# EasyEDA Pro project watch-baseboard-v1.epro

# Schematic Schematic1
Board Name: Board1; Create Date: 2025-02-13; Page Name: P1; Project Name: watch-baseboard-v1; Schematic Name: Schematic1; Update Date: 2025-05-31; Company: 嘉立创EDA; Page Size: A4; Version: V1.0
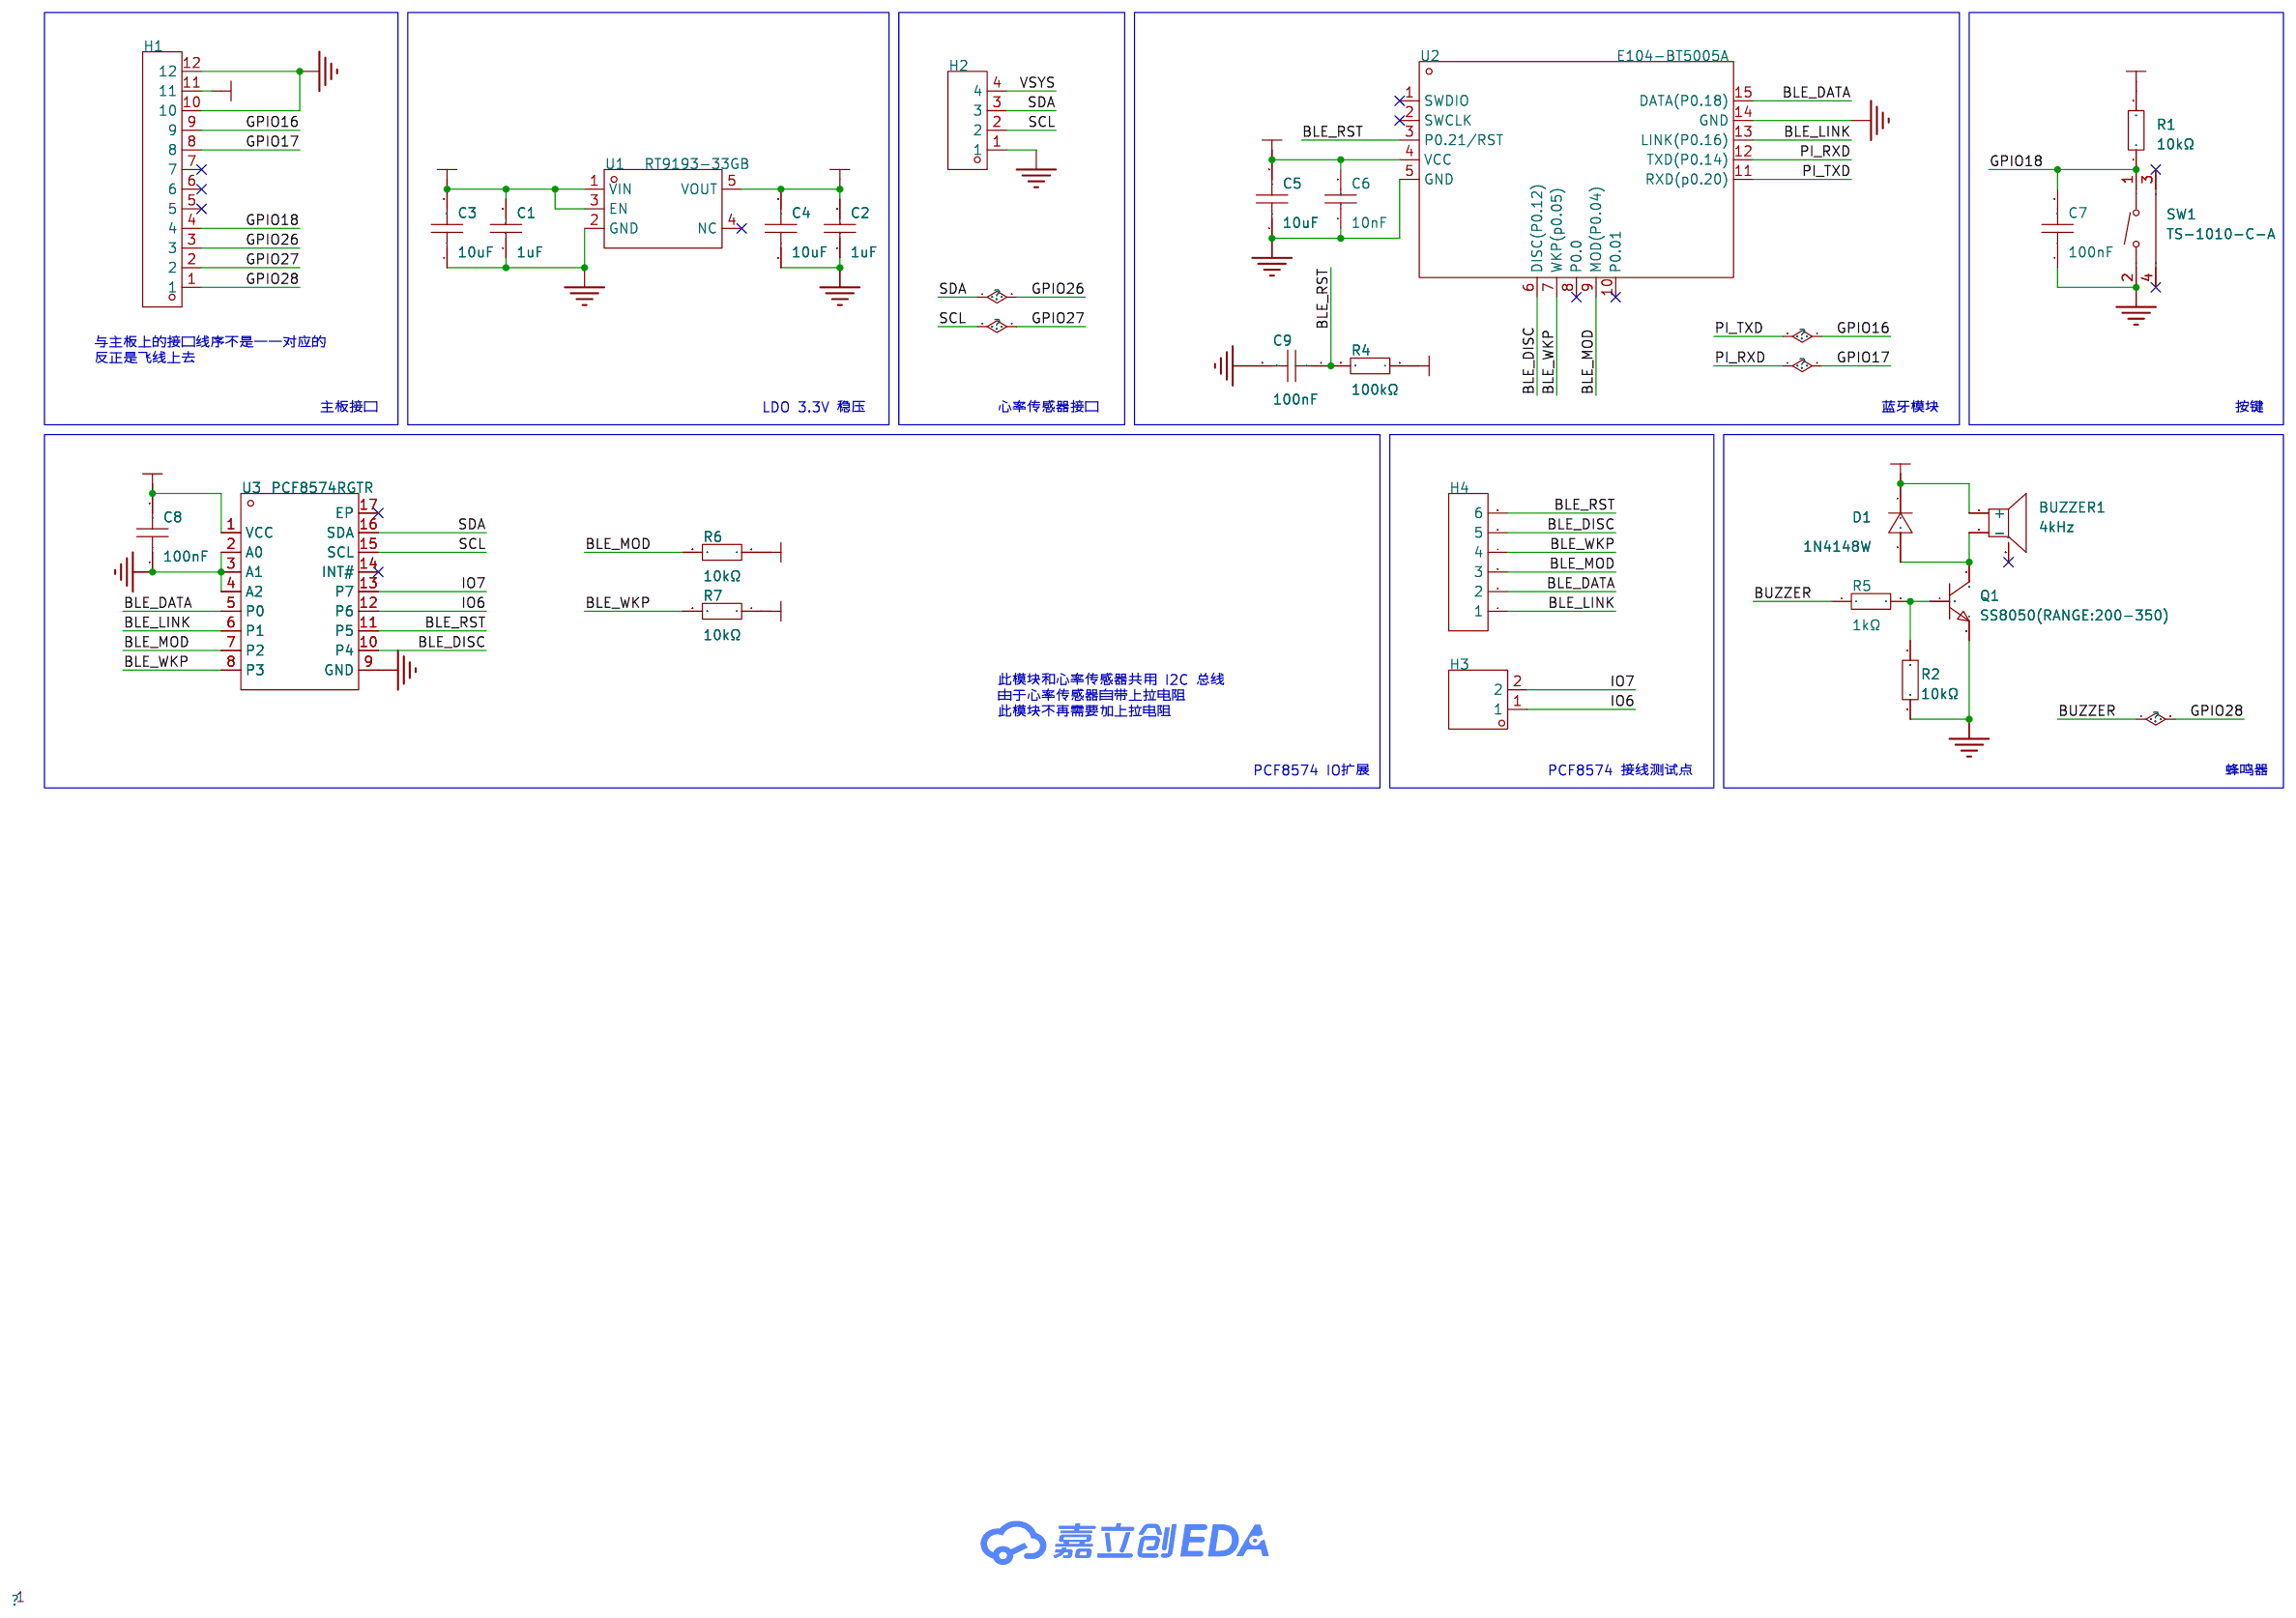
[diagram p0: schematic sheet]

## Parts
BUZZER1  4kHz  [BUZ-SMD_L5.0-W5.5-P4.60]
C1  1uF  [C0805]
C2  1uF  [C0805]
C3  10uF  [C0805]
C4  10uF  [C0805]
C5  10uF  [C0805]
C6  10nF  [C0805]
C7  100nF  [C0805]
C8  100nF  [C0805]
C9  100nF  [C0805]
D1  1N4148W  [SOD-123_L2.8-W1.8-LS3.7-RD]
H1  -  [HDR-TH_12P-P2.54-V-M]
H2  -  [HDR-TH_4P-P2.54-V-M]
H3  -  [HDR-TH_2P-P2.54-V-M-1]
H4  -  [HDR-TH_6P-P2.54-V-M-1]
Q1  SS8050(RANGE:200-350)  [SOT-23-3_L2.9-W1.3-P1.90-LS2.4-BR]
R1  10kΩ  [R0805]
R2  10kΩ  [R0805]
R4  100kΩ  [R0805]
R5  1kΩ  [R0805]
R6  10kΩ  [R0805]
R7  10kΩ  [R0805]
SW1  TS-1010-C-A  [KEY-SMD_TX-1010-X-X]
U1  RT9193-33GB  [SOT-23-5_L3.0-W1.5-P0.95-LS2.8-BL]
U2  E104-BT5005A  [BULETM-SMD_E104-BT5005A]
U3  PCF8574RGTR  [WQFN-16_L3.0-W3.0-P0.50-TL-EP1.6]

## Library data of the parts
BUZZER1 = MLT-5020: 驱动方式:无源(外部驱动);构造类型:电磁式;频率:4kHz;; Supplier Part: C94598; Manufacturer: 华能; Supplier Footprint: SMD,5x5mm; JLCPCB Part Class: 扩展库; Datasheet: https://atta.szlcsc.com/upload/public/pdf/source/20210811/111454390007D221D7259018FB170E62.pdf; Supplier: LCSC; Driver Circuitry: 无源(外部驱动); Technology: 电磁式; Length: 5.2mm; Width: 5.2mm; Height: 2.5mm
C1 C2 = CL21B105KBFNNNE: 容值:1uF;精度:±10%;额定电压:50V;材质(温度系数):X7R;; LCSC Part Name: 1uF ±10% 50V; Supplier Part: C28323; Manufacturer: SAMSUNG(三星); Supplier Footprint: 0805; JLCPCB Part Class: 基础库; Datasheet: https://atta.szlcsc.com/upload/public/pdf/source/20160218/1457707763339.pdf; Supplier: LCSC; Tolerance: ±10%; Voltage Rated: 50V; Temperature Coefficient: X7R
C3-C5 = CL21A106KAYNNNE_C15850: 容值:10uF;精度:±10%;额定电压:25V;材质(温度系数):X5R;; LCSC Part Name: 10uF ±10% 25V; Supplier Part: C15850; Manufacturer: SAMSUNG(三星); Manufacturer Part: CL21A106KAYNNNE; Supplier Footprint: 0805; JLCPCB Part Class: 基础库; Datasheet: https://atta.szlcsc.com/upload/public/pdf/source/20160218/1457707763339.pdf; Supplier: LCSC; Tolerance: ±10%; Voltage Rated: 25V; Temperature Coefficient: X5R
C6 = CL21B103KBANNNC: 容值:10nF;精度:±10%;额定电压:50V;材质(温度系数):X7R;; LCSC Part Name: 10nF ±10% 50V; Supplier Part: C1710; Manufacturer: SAMSUNG(三星); Supplier Footprint: 0805; JLCPCB Part Class: 基础库; Datasheet: https://atta.szlcsc.com/upload/public/pdf/source/20160218/1457707763339.pdf; Supplier: LCSC; Tolerance: ±10%; Voltage Rated: 50V; Temperature Coefficient: X7R
C7-C9 = CC0805KRX7R9BB104: 容值:100nF;精度:±10%;额定电压:50V;材质(温度系数):X7R;; LCSC Part Name: 100nF ±10% 50V; Supplier Part: C49678; Manufacturer: YAGEO(国巨); Supplier Footprint: 0805; JLCPCB Part Class: 基础库; Datasheet: https://atta.szlcsc.com/upload/public/pdf/source/20180224/C181747_15194369449651363981.pdf; Supplier: LCSC; Tolerance: ±10%; Voltage Rated: 50V; Temperature Coefficient: X7R
D1 = 1N4148W_C2099: 二极管配置:独立式;正向压降(Vf):1.25V@150mA;直流反向耐压(Vr):100V;整流电流:150mA;反向恢复时间(trr):4ns;; LCSC Part Name: 丝印T4; Supplier Part: C2099; Manufacturer: CJ(江苏长电/长晶); Supplier Footprint: SOD-123; JLCPCB Part Class: 扩展库; Datasheet: https://atta.szlcsc.com/upload/public/pdf/source/20120428/1457706480199.pdf; Supplier: LCSC; Diode Configuration: 独立式; Forward Voltage (Vf@If): 1.25V@150mA; Reverse Voltage (Vr): 100V; Rectified Current: 150mA; Reverse Leakage Current: 1uA@75V; Reverse Recovery Time (trr): 4ns
H1 = HDR-M_2.54_1x12P: 间距:2.54mm;总PIN位数:12;排数:1;插针结构:1x12P;行距:-;安装类型:直插;圆针/方针:方针;额定电流:3A;额定电压:250V;配合针长度:6mm;塑高:2.5mm;端接针长度:3mm;触头材质:-;工作温度范围:-40℃~+105℃;颜色:黑色;; Supplier Part: C2840012; Supplier Footprint: 插件
H2 = HDR-M_2.54_1x4P: Supplier Part: C492403; Supplier Footprint: 插件
H3 = HDR-M_2.54_1x2P: Supplier Part: C124375; Supplier Footprint: 插件
H4 = HDR-M_2.54_1x6P: Supplier Part: C37208; Supplier Footprint: 插件
Q1 = SS8050(RANGE:200-350)_C2150: 晶体管类型:NPN;集电极电流(Ic):1.5A;集射极击穿电压(Vceo):25V;功率(Pd):300mW;直流电流增益(hFE@Ic,Vce):200@800mA,1V;; LCSC Part Name: NPN 电流:1.5A 耐压:25V hfe=200~350; Supplier Part: C2150; Manufacturer: CJ(江苏长电/长晶); Supplier Footprint: SOT-23; JLCPCB Part Class: 基础库; Datasheet: https://atta.szlcsc.com/upload/public/pdf/source/20230322/AEE86F4B043774EFF80CAEA14A37D9E9.pdf; Supplier: LCSC; Transistor Type: NPN; Collector Current (Ic): 1.5A; Collector-Emitter Breakdown Voltage (Vceo): 25V; Power Dissipation (Pd): 300mW; DC Current Gain (hFE@Ic,Vce): 200@800mA,1V; Transition Frequency (fT): 100MHz; Collector Cut-Off Current (Icbo): 100nA; Collector-Emitter Saturation Voltage (VCE(sat)@Ic,Ib): 500mV@800mA,80mA; Operating Temperature: -55℃~+150℃
R1 R2 R6 R7 = 0805W8F1002T5E_C17414: 电阻类型:厚膜电阻;阻值:10kΩ;精度:±1%;功率:125mW;最大工作电压:150V;温度系数:±100ppm/℃;; LCSC Part Name: 10kΩ ±1% 125mW 厚膜电阻; Supplier Part: C17414; Manufacturer: UNI-ROYAL(厚声); Manufacturer Part: 0805W8F1002T5E; Supplier Footprint: 0805; JLCPCB Part Class: 基础库; Datasheet: https://atta.szlcsc.com/upload/public/pdf/source/20200306/C422600_1E6D84923E4A46A82E41ADD87F860B5C.pdf; Supplier: LCSC; Type: 厚膜电阻; Tolerance: ±1%; Power(Watts): 125mW; Overload Voltage (Max): 150V; Temperature Coefficient: ±100ppm/℃; Operating Temperature Range: -55℃~+155℃
R4 = 0805W8F1003T5E: 电阻类型:厚膜电阻;阻值:100kΩ;精度:±1%;功率:125mW;最大工作电压:150V;温度系数:±100ppm/℃;; LCSC Part Name: 100kΩ ±1% 125mW 厚膜电阻; Supplier Part: C149504; Manufacturer: UNI-ROYAL(厚声); Supplier Footprint: 0805; JLCPCB Part Class: 基础库; Datasheet: https://atta.szlcsc.com/upload/public/pdf/source/20200306/C422600_1E6D84923E4A46A82E41ADD87F860B5C.pdf; Supplier: LCSC; Type: 厚膜电阻; Tolerance: ±1%; Power(Watts): 125mW; Overload Voltage (Max): 150V; Temperature Coefficient: ±100ppm/℃; Operating Temperature Range: -55℃~+155℃
R5 = 0805W8F1001T5E: 电阻类型:厚膜电阻;阻值:1kΩ;精度:±1%;功率:125mW;最大工作电压:150V;温度系数:±100ppm/℃;; LCSC Part Name: 1kΩ ±1% 125mW 厚膜电阻; Supplier Part: C17513; Manufacturer: UNI-ROYAL(厚声); Supplier Footprint: 0805; JLCPCB Part Class: 基础库; Datasheet: https://atta.szlcsc.com/upload/public/pdf/source/20200306/C422600_1E6D84923E4A46A82E41ADD87F860B5C.pdf; Supplier: LCSC; Type: 厚膜电阻; Tolerance: ±1%; Power(Watts): 125mW; Overload Voltage (Max): 150V; Temperature Coefficient: ±100ppm/℃; Operating Temperature Range: -55℃~+155℃
SW1 = TS-1010-C-A: 电路结构:单刀单掷;按钮形状:矩形按钮;作用力:260gf;安装方式:卧贴;开关长度:2.3mm;开关宽度:4.7mm;开关高度:3.5mm;带支架:不带;触点电流:50mA;额定电压(AC):-;额定电压(DC):12V;额定功率:-;绝缘电阻:-;带灯:无;机械寿命:10万次;; LCSC Part Name: 2.3*4.7*3.5mm 卧贴 轻触开关; Supplier Part: C692458; Manufacturer: XKB Connectivity(中国星坤); Supplier Footprint: SMD; JLCPCB Part Class: 扩展库; Datasheet: https://atta.szlcsc.com/upload/public/pdf/source/20211011/09621D275CE0F472C941775DFBBCCC96.pdf; Supplier: LCSC; Circuit: 单刀单掷; Actuator Style: 矩形按钮; Operating Force: 260gf; Mounting Style: 卧贴; Switch Length: 2.3mm; Switch Width: 4.7mm; Switch Height: 3.5mm; Strike Gundam: 不带; Contact Current: 50mA; Voltage Rating (DC): 12V; Actuator/Cap Color: 黑色; With Lamp: 无; Mechanical Life: 10万次; Operating Temperature: -30℃~+85℃
U1 = RT9193-33GB_C19268156: Supplier Part: C19268156; Manufacturer: TECH PUBLIC(台舟); Supplier Footprint: SOT-23-5; JLCPCB Part Class: 扩展库; Datasheet: https://atta.szlcsc.com/upload/public/pdf/source/20231201/0E4AA64A86672323DAF7A55761D39120.pdf; Supplier: LCSC
U2 = E104-BT5005A: 基于nRF52805蓝牙协议 5.0 版本的串口转 BLE 蓝牙主从一体模块，体积小、功耗低，工作在 2.4GHz 频段。模块仅支持蓝牙主机、从机和观察者模式，模块在功能上支持低功耗广播、数据透传、空中配置。; LCSC Part Name: nRF52805 BLE5.0 低功耗蓝牙转串口模块; Supplier Part: C2874127; Manufacturer: EBYTE(亿佰特); Supplier Footprint: SMD; JLCPCB Part Class: 扩展库; Datasheet: https://atta.szlcsc.com/upload/public/pdf/source/20230131/53D67A473CAB63C2914FF2C9CC8CB02B.pdf; Supplier: LCSC
U3 = PCF8574RGTR: 接口:-;; Supplier Part: C2652270; Manufacturer: TI(德州仪器); Supplier Footprint: WQFN-16-EP(3x3); JLCPCB Part Class: 扩展库; Datasheet: https://www.ti.com/cn/lit/gpn/pcf8574; Supplier: LCSC

## Nets
3V3: BUZZER1.1(+) C2.2 C4.2 C5.2 C6.2 C8.2 D1.1(K) R1.2 R4.1 R6.1 R7.1 U1.5(VOUT) U2.4(VCC) U3.1(VCC)
GND: C1.1 C2.1 C3.1 C4.1 C5.1 C6.1 C7.1 C8.1 C9.2 H1.10 H1.12 H2.1 Q1.2(E) R2.1 SW1.2 U1.2(GND) U2.5(GND) U2.14(GND) U3.2(A0) U3.3(A1) U3.4(A2) U3.9(GND)
BLE_DATA: H4.2 U2.15(DATA(P0.18)) U3.5(P0)
BLE_DISC: H4.5 U2.6(DISC(P0.12)) U3.10(P4)
BLE_LINK: H4.1 U2.13(LINK(P0.16)) U3.6(P1)
BLE_MOD: H4.3 R6.2 U2.9(MOD(P0.04)) U3.7(P2)
BLE_RST: C9.1 H4.6 R4.2 U2.3(P0.21/RST) U3.11(P5)
BLE_WKP: H4.4 R7.2 U2.7(WKP(p0.05)) U3.8(P3)
BUZZER: H1.1 R5.1
GPIO16: H1.9 U2.11(RXD(p0.20))
GPIO17: H1.8 U2.12(TXD(P0.14))
GPIO18: C7.2 H1.4 R1.1 SW1.1
GPIO26: H1.3 H2.3 U3.16(SDA)
GPIO27: H1.2 H2.2 U3.15(SCL)
IO6: H3.1 U3.12(P6)
IO7: H3.2 U3.13(P7)
VSYS: C1.2 C3.2 H1.11 H2.4 U1.1(VIN) U1.3(EN)
$1N4188: Q1.1(B) R2.2 R5.2
$1N4201: BUZZER1.2(-) D1.2(A) Q1.3(C)

Not connected (* = marked no-connect by the designer): BUZZER1 3(NC)*; H1 5* 6* 7*; SW1 3* 4*; U1 4(NC)*; U2 1(SWDIO)* 2(SWCLK)* 8(P0.0)* 10(P0.01)*; U3 14(INT#)* 17(EP)*

## Notes on the sheet
- 与主板上的接口线序不是一一对应的
  反正是飞线上去
- 主板接口
- LDO 3.3V 稳压
- 心率传感器接口
- 蓝牙模块
- 按键
- 此模块和心率传感器共用 I2C 总线
  由于心率传感器自带上拉电阻
  此模块不再需要加上拉电阻
- PCF8574 IO扩展
- PCF8574 接线测试点
- 蜂鸣器

# Board PCB1
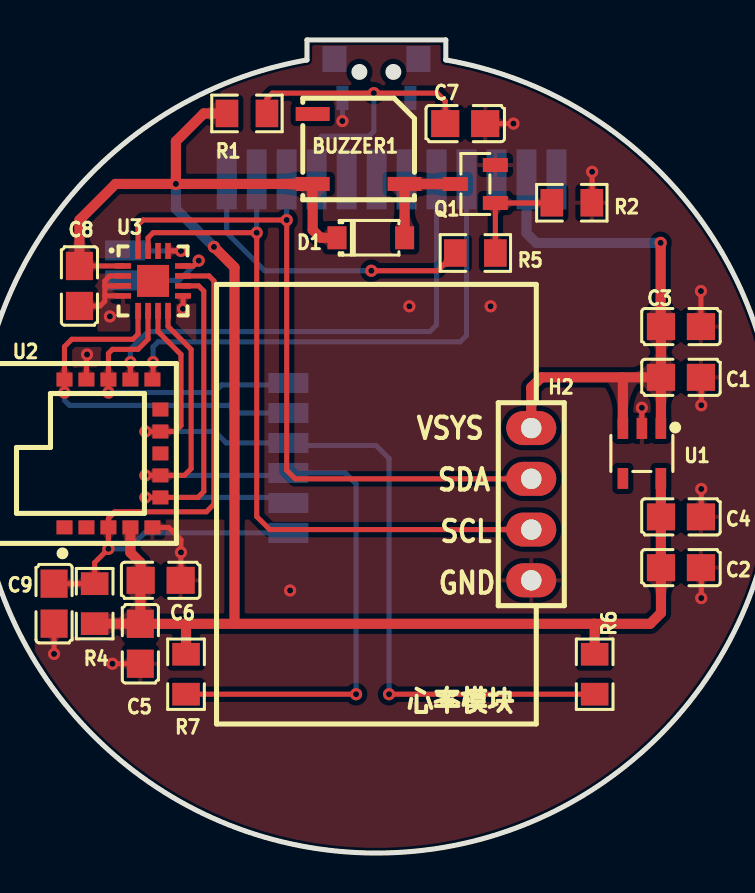
[diagram p1: board, top side]
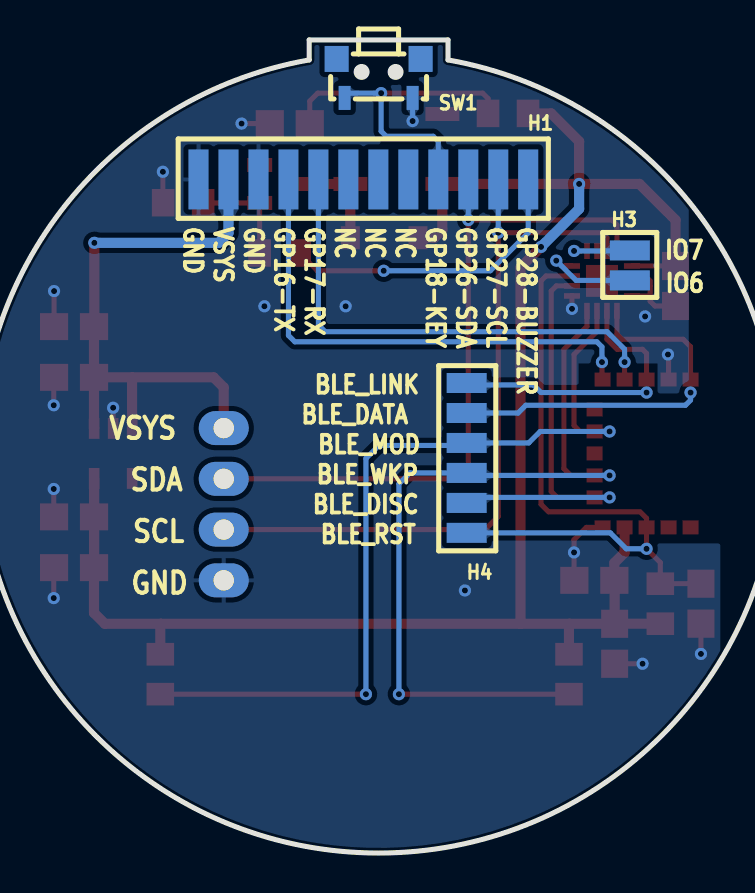
[diagram p2: board, bottom side, seen from below]

Outline 40 x 40.7 mm; copper layers: Top Layer, Bottom Layer. Coordinates in mm from the lower left corner of the outline.
Outline path: 16.53,40.7 23.48,40.7 23.48,39.7 arc(20,0) 16.53,39.7 16.53,40.7
Stack: Top Layer 0.035mm / Dielectric1 1.51mm FR4 er 4.5 / Bottom Layer 0.035mm

## Design rules (mm)
template: JLCPCB Capability(Two Layers Board)
spacing copperThickness1oz (default): track to track 0.102, other pairs 0.152 to 0.3
spacing copperThickness2oz: track to track 0.203, other pairs 0.152 to 0.3
track width copperThickness1oz (default): min 0.127, default 0.254, max 2.54
track width copperThickness2oz: min 0.203, default 0.254, max 2.54
differential pair differentialPair (default): width min 0.127, default 0.254, max 2.54; gap min 0.152, default 0.152
via viaSize (default): diameter min 0.5, default 0.61, max 10; hole min 0.3, default 0.305, max 6.3

## Placement (name value [footprint] x y rotation side)
BUZZER1  4kHz  [BUZ-SMD_L5.0-W5.5-P4.60]  19.11 35.24 0 top
C1  1uF  [C0805]  35.24 23.81 180 top
C2  1uF  [C0805]  35.24 14.28 180 top
C3  10uF  [C0805]  35.24 26.35 180 top
C4  10uF  [C0805]  35.24 16.82 180 top
C5  10uF  [C0805]  8.19 10.47 90 top
C6  10nF  [C0805]  9.21 13.65 180 top
C7  100nF  [C0805]  24.45 36.51 180 top
C8  100nF  [C0805]  5.14 28.38 90 top
C9  100nF  [C0805]  3.87 12.48 270 top
D1  1N4148W  [SOD-123_L2.8-W1.8-LS3.7-RD]  19.72 30.79 0 top
H1  -  [HDR-TH_12P-P2.54-V-M]  20.77 33.72 0 bottom
H2  -  [HDR-TH_4P-P2.54-V-M]  27.75 17.46 90 top
H3  -  [HDR-TH_2P-P2.54-V-M-1]  7.43 29.4 90 bottom
H4  -  [HDR-TH_6P-P2.54-V-M-1]  15.69 16.06 270 bottom
Q1  SS8050(RANGE:200-350)  [SOT-23-3_L2.9-W1.3-P1.90-LS2.4-BR]  24.96 33.49 0 top
R1  10kΩ  [R0805]  13.53 37.02 180 top
R2  10kΩ  [R0805]  29.78 32.55 180 top
R4  100kΩ  [R0805]  5.91 12.48 90 top
R5  1kΩ  [R0805]  24.96 30.03 0 top
R6  10kΩ  [R0805]  30.93 8.95 270 top
R7  10kΩ  [R0805]  10.48 8.95 270 top
SW1  TS-1010-C-A  [KEY-SMD_TX-1010-X-X]  20 38.77 180 bottom
U1  RT9193-33GB  [SOT-23-5_L3.0-W1.5-P0.95-LS2.8-BL]  33.29 20 180 top
U2  E104-BT5005A  [BULETM-SMD_E104-BT5005A]  6.8 20 90 top
U3  PCF8574RGTR  [WQFN-16_L3.0-W3.0-P0.50-TL-EP1.6]  8.83 28.64 0 top

## Footprints (pads in the part's own frame, mm; a bottom-side part is the same pattern mirrored in y, then rotated)
BULETM-SMD_E104-BT5005A
  rect 0.7x0.8 smd: 1(-3.7,2.4) 2(-3.7,1.3) 3(-3.7,0.2) 4(-3.7,-0.9) 5(-3.7,-2) 6(-2.2,-2.4) 7(-1.1,-2.4) 8(0,-2.4) 9(1.1,-2.4) 10(2.2,-2.4) 11(3.7,-2) 12(3.7,-0.9) 13(3.7,0.2) 14(3.7,1.3) 15(3.7,2.4)
BUZ-SMD_L5.0-W5.5-P4.60
  rect 1.7x0.7 smd: 1(-2.3,-1.75) 2(2.3,-1.75) 3(-2.3,1.75)
C0805
  rect 1.41x1.35 smd: 1(-1,0) 2(1,0)
HDR-TH_2P-P2.54-V-M-1
  rect 1x2 smd: 1(-0.737,0) 2(0.763,0)
HDR-TH_4P-P2.54-V-M
  oval 1.7x2.5 hole 1.02: 1(-3.81,0) 2(-1.27,0) 3(1.27,0) 4(3.81,0)
HDR-TH_6P-P2.54-V-M-1
  rect 1x2 smd: 1(-7.463,0.089) 2(-5.963,0.089) 3(-4.463,0.089) 4(-2.962,0.089) 5(-1.462,0.089) 6(0.037,0.089)
HDR-TH_12P-P2.54-V-M
  rect 1x3 smd: 1(-8.25,0) 2(-6.75,0) 3(-5.25,0) 4(-3.75,0) 5(-2.25,0) 6(-0.75,0) 7(0.75,0) 8(2.25,0) 9(3.75,0) 10(5.25,0) 11(6.75,0) 12(8.25,0)
KEY-SMD_TX-1010-X-X
  rect 0.6x1.2 smd: 1(-1.7,-0.975) 2(1.7,-0.975)
  rect 1.2x1.3 smd: 3(-2.1,0.975) 4(2.1,0.975)
R0805
  rect 1.133x1.377 smd: 1(-1,0) 2(1,0)
SOD-123_L2.8-W1.8-LS3.7-RD
  rect 0.95x1.15 smd: 1(-1.692,0) 2(1.692,0)
SOT-23-3_L2.9-W1.3-P1.90-LS2.4-BR
  rect 1.25x0.7 smd: 1(1,-0.95) 2(1,0.95) 3(-1,0)
SOT-23-5_L3.0-W1.5-P0.95-LS2.8-BL
  rect 0.532x1.045 smd: 1(-0.95,-1.25) 2(0,-1.25) 3(0.95,-1.25) 4(0.95,1.25) 5(-0.95,1.25)
WQFN-16_L3.0-W3.0-P0.50-TL-EP1.6
  rect 0.8x0.28 smd: 1(-1.5,0.749) 2(-1.5,0.249) 3(-1.5,-0.249) 4(-1.5,-0.75) 9(1.5,-0.75) 10(1.5,-0.249) 11(1.5,0.249) 12(1.5,0.749)
  rect 0.28x0.8 smd: 5(-0.749,-1.5) 6(-0.249,-1.5) 7(0.249,-1.5) 8(0.75,-1.5) 13(0.75,1.5) 14(0.249,1.5) 15(-0.249,1.5) 16(-0.749,1.5)
  rect 1.6x1.6 smd: 17(0,0)

## Nets
As in the schematic.

Pads without a net: BUZZER1 3; H1 5 6 7; SW1 3 4; U1 4; U2 1 2 8 10; U3 14 17

## Via types
v1: diameter 0.61, hole 0.305, Top Layer to Bottom Layer, 36 vias

## Routing (per net, layer and track width the routed paths; a pad name or vN(x,y) marks a point on that pad's centre or on a via; arc(x,y) is an arc through that point)
3V3: length 92.5
  Top Layer w0.254: C8.2 5.15,29.38 U3.1
  Top Layer w0.508: v1(11.88,30.34) 12.9,29.31 12.9,11.47 ; 10.46,11.47 10.48,11.45 R7.1 ; 10.46,11.47 C5.2 ; 10.46,11.47 12.9,11.47 ; U1.5 34.24,14.29 C2.2 34.24,12.01 33.7,11.47 30.9,11.47 ; D1.1 17.21,30.79 16.81,31.19 16.81,33.49 v1(9.97,33.49) ; R1.2 11.37,37.02 9.97,35.62 v1(9.97,33.49) ; C8.2 5.14,31.68 6.95,33.49 v1(9.97,33.49) ; R4.1 8.19,11.48 C5.2 ; 30.9,11.47 30.93,11.45 R6.1 ; 30.9,11.47 12.9,11.47 ; C5.2 8.19,13.63 C6.2 8.21,14.52 7.7,15.04 U2.4
  Bottom Layer w0.508: v1(11.88,30.34) 9.97,32.24 v1(9.97,33.49)
GND: length 25.1
  Top Layer w0.254: 6.41,27.91 6.41,27.62 6.18,27.38 C8.1 ; 6.41,27.91 6.44,27.89 U3.4 ; 6.41,27.91 6.41,28.38 ; C4.1 36.26,16.84 v1(36.26,18.22) ; v1(36.26,12.76) 36.26,14.27 C2.1 ; C6.1 10.22,13.67 v1(10.22,15.05) 10.22,15.68 9.61,16.3 U2.5 ; v1(36.26,22.41) 36.26,23.79 C1.1 ; C9.2 v1(3.87,9.97) ; v1(30.8,34.1) 30.8,32.56 R2.1 ; U3.3 6.42,28.39 6.41,28.38 ; U3.2 6.66,28.88 6.41,28.64 6.41,28.38 ; v1(5.53,24.95) 5.5,24.92 U2.14 ; C3.1 v1(36.24,28.13) ; C5.1 v1(6.8,9.47) ; U3.9 v1(10.33,27.24) ; U1.2 v1(33.29,22.29) ; C7.1 v1(26.86,36.51)
  Bottom Layer w0.254: SW1.2 v1(18.3,36.64)
  vias: v1(6.67,26.86) v1(15.69,13.14) v1(21.65,27.37) v1(25.72,27.37)
BLE_DATA: length 19.3
  Top Layer w0.254: v1(4.4,23.05) U2.15 4.4,25.35 4.76,25.71 7.82,25.71 8.08,25.97 U3.5
  Bottom Layer w0.254: H4.2 13.02,22.03 12.64,22.41 4.65,22.41 4.4,22.67 v1(4.4,23.05)
BLE_DISC: length 21.5
  Top Layer w0.254: U3.10 11.11,28.39 11.37,28.13 11.37,18.09 11.07,17.8 U2.6 v1(8.45,17.8)
  Bottom Layer w0.254: H4.5 15.32,17.8 v1(8.45,17.8)
BLE_LINK: length 14.9
  Top Layer w0.254: U3.6 8.58,25.72 8.07,25.21 6.8,25.21 6.6,25.01 U2.13 v1(6.6,23.05)
  Bottom Layer w0.254: H4.1 15.5,23.43 12.26,23.43 11.88,23.05 v1(6.6,23.05)
BLE_MOD: length 43
  Top Layer w0.254: U3.7 9.08,26.1 10.22,24.95 10.22,21.4 9.93,21.1 U2.9 v1(8.45,21.1) ; v1(20.64,7.95) R6.2
  Bottom Layer w0.254: v1(8.45,21.1) 11.92,21.1 12.49,20.53 H4.3 15.72,20.4 19.99,20.4 20.64,19.75 v1(20.64,7.95)
BLE_RST: length 33.3
  Top Layer w0.254: U3.11 11.63,28.88 11.88,28.64 11.88,17.46 11.49,17.08 6.92,17.08 6.6,16.75 U2.3 v1(6.6,15.23) 5.91,14.54 R4.2 C9.1
  Bottom Layer w0.254: v1(6.6,15.23) 7.61,15.23 8.41,16.03 H4.6
BLE_WKP: length 40.7
  Top Layer w0.254: U3.8 9.58,26.36 10.73,25.21 10.73,19.24 10.39,18.9 U2.7 v1(8.45,18.9) ; v1(18.99,7.95) R7.2
  Bottom Layer w0.254: v1(18.99,7.95) 18.99,18.48 18.44,19.03 H4.4 15.47,18.9 v1(8.45,18.9)
BUZZER: length 15.3
  Top Layer w0.254: R5.1 23.07,29.14 v1(19.75,29.14)
  Bottom Layer w0.254: H1.1 12.52,31.04 14.42,29.14 v1(19.75,29.14)
GPIO16: length 25.4
  Top Layer w0.254: v1(8.83,24.57) 8.83,23.73 U2.11
  Bottom Layer w0.254: H1.9 24.52,25.91 24.19,25.59 9.08,25.59 8.83,25.33 v1(8.83,24.57)
GPIO17: length 24.6
  Top Layer w0.254: U2.12 v1(7.7,24.57)
  Bottom Layer w0.254: v1(7.7,24.57) 7.7,25.22 8.57,26.1 22.67,26.1 23.02,26.44 H1.8
GPIO18: length 19.9
  Top Layer w0.254: C7.2 23.45,37.64 23.05,38.03 v1(19.88,38.03) 14.8,38.03 14.53,37.76 R1.1
  Bottom Layer w0.254: H1.4 17.02,35.62 17.27,35.87 19.62,35.87 19.88,36.13 v1(19.88,38.03) 21.46,38.03 SW1.1
GPIO26: length 35.8
  Top Layer w0.254: U3.16 8.08,31.44 8.32,31.68 v1(15.52,31.68) 15.52,19.15 15.94,18.73 H2.3
  Bottom Layer w0.254: H1.3 v1(15.52,31.68)
GPIO27: length 37.1
  Top Layer w0.254: H2.2 14.67,16.19 14.02,16.84 v1(14.02,31.05) 8.83,31.05 8.58,30.79 U3.15
  Bottom Layer w0.254: H1.2 v1(14.02,31.05)
IO6: length 5
  Top Layer w0.254: U3.12 10.85,29.38 v1(11.11,29.65)
  Bottom Layer w0.254: H3.1 10.12,28.66 v1(11.11,29.65)
IO7: length 3.5
  Top Layer w0.254: U3.13 v1(10.22,30.14)
  Bottom Layer w0.254: v1(10.22,30.14) 7.46,30.14 H3.2
VSYS: length 30.2
  Top Layer w0.508: U1.3 32.34,23.81 ; H2.4 27.75,23.3 28.26,23.81 C1.2 ; C1.2 C3.2 34.23,26.37 v1(34.23,30.54) ; C1.2 34.24,21.26 U1.1
  Bottom Layer w0.508: H1.11 27.52,31.03 28,30.54 v1(34.23,30.54)
$1N4188: length 5.3
  Top Layer w0.254: R5.2 Q1.1 28.77,32.54 R2.2
$1N4201: length 5.2
  Top Layer w0.508: D1.2 21.42,33.49 BUZZER1.2 ; Q1.3 21.42,33.49

## Copper pours and planes (outline as drawn; the poured copper is in the pictures)
GND on Top Layer: -4.25,42.73 41.85,42.73 41.85,-2.48 -4.25,-2.48
GND on Bottom Layer: -5.65,43.49 45.53,43.49 45.53,-4.77 -5.65,-4.77

Small or netless copper shapes (teardrops, artwork), in the pictures only: 103 on Top Layer, 35 on Bottom Layer

## Text on the board
Bottom Silkscreen Layer: IO6 | IO7 | BLE_RST | BLE_MOD | BLE_WKP | BLE_LINK | BLE_DISC | BLE_DATA | GP28-BUZZER | GP27-SCL | GP26-SDA | GP18-KEY | NC | GP17-RX | GP16-TX | GND | VSYS | SCL | SDA
Top Silkscreen Layer: VSYS | SDA | GND | SCL | 心率模块
